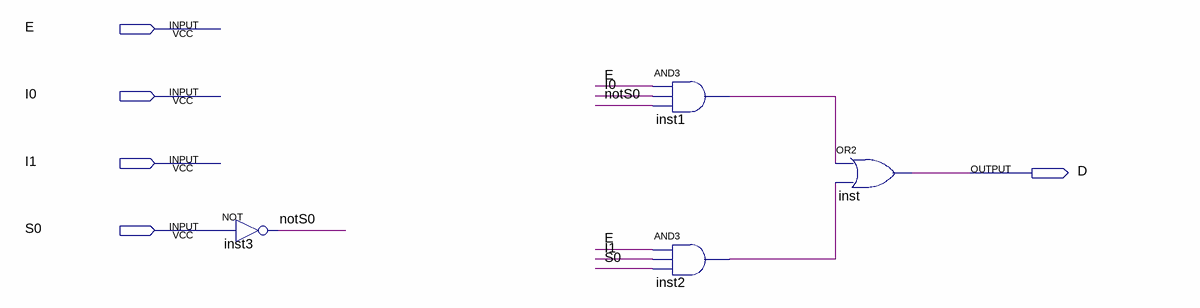
[diagram p0: schematic sheet]
// Quartus schematic mp2-1_1.bdf as structural Verilog: 4 symbols, 5 pins
module \mp2-1_1  (
  input  E,
  input  I0,
  input  I1,
  input  S0,
  output D
);

  wire inst1_out, inst2_out, notS0;

  not inst3 (notS0, S0);
  and inst1 (inst1_out, E, I0, notS0);
  and inst2 (inst2_out, E, I1, S0);
  or inst (D, inst1_out, inst2_out);
endmodule
